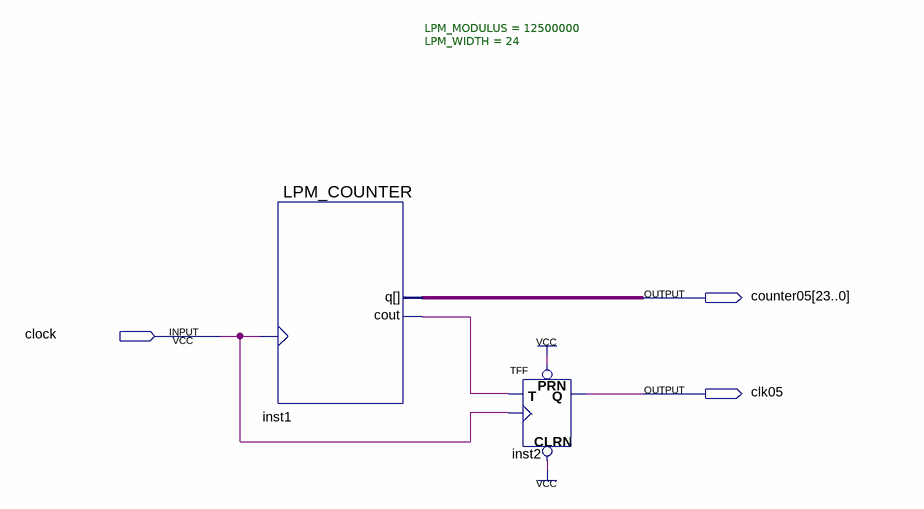
[diagram p0: schematic sheet]
// Quartus schematic lpm05.bdf as structural Verilog: 2 symbols, 3 pins
module lpm05 (
  input  clock,
  output [23:0] counter05,
  output clk05
);

  wire inst1_cout;

  LPM_COUNTER #(.LPM_MODULUS(12500000), .LPM_WIDTH(24)) inst1 (.clock(clock), .cout(inst1_cout), .q(counter05));
  TFF inst2 (.PRN(1'b1), .CLRN(1'b1), .T(inst1_cout), .CLK(clock), .Q(clk05));
endmodule
